# Altium schematic sheet Microcontroller.SchDoc: Microcontroller
size B; SheetNumber: 2; SheetTotal: 14
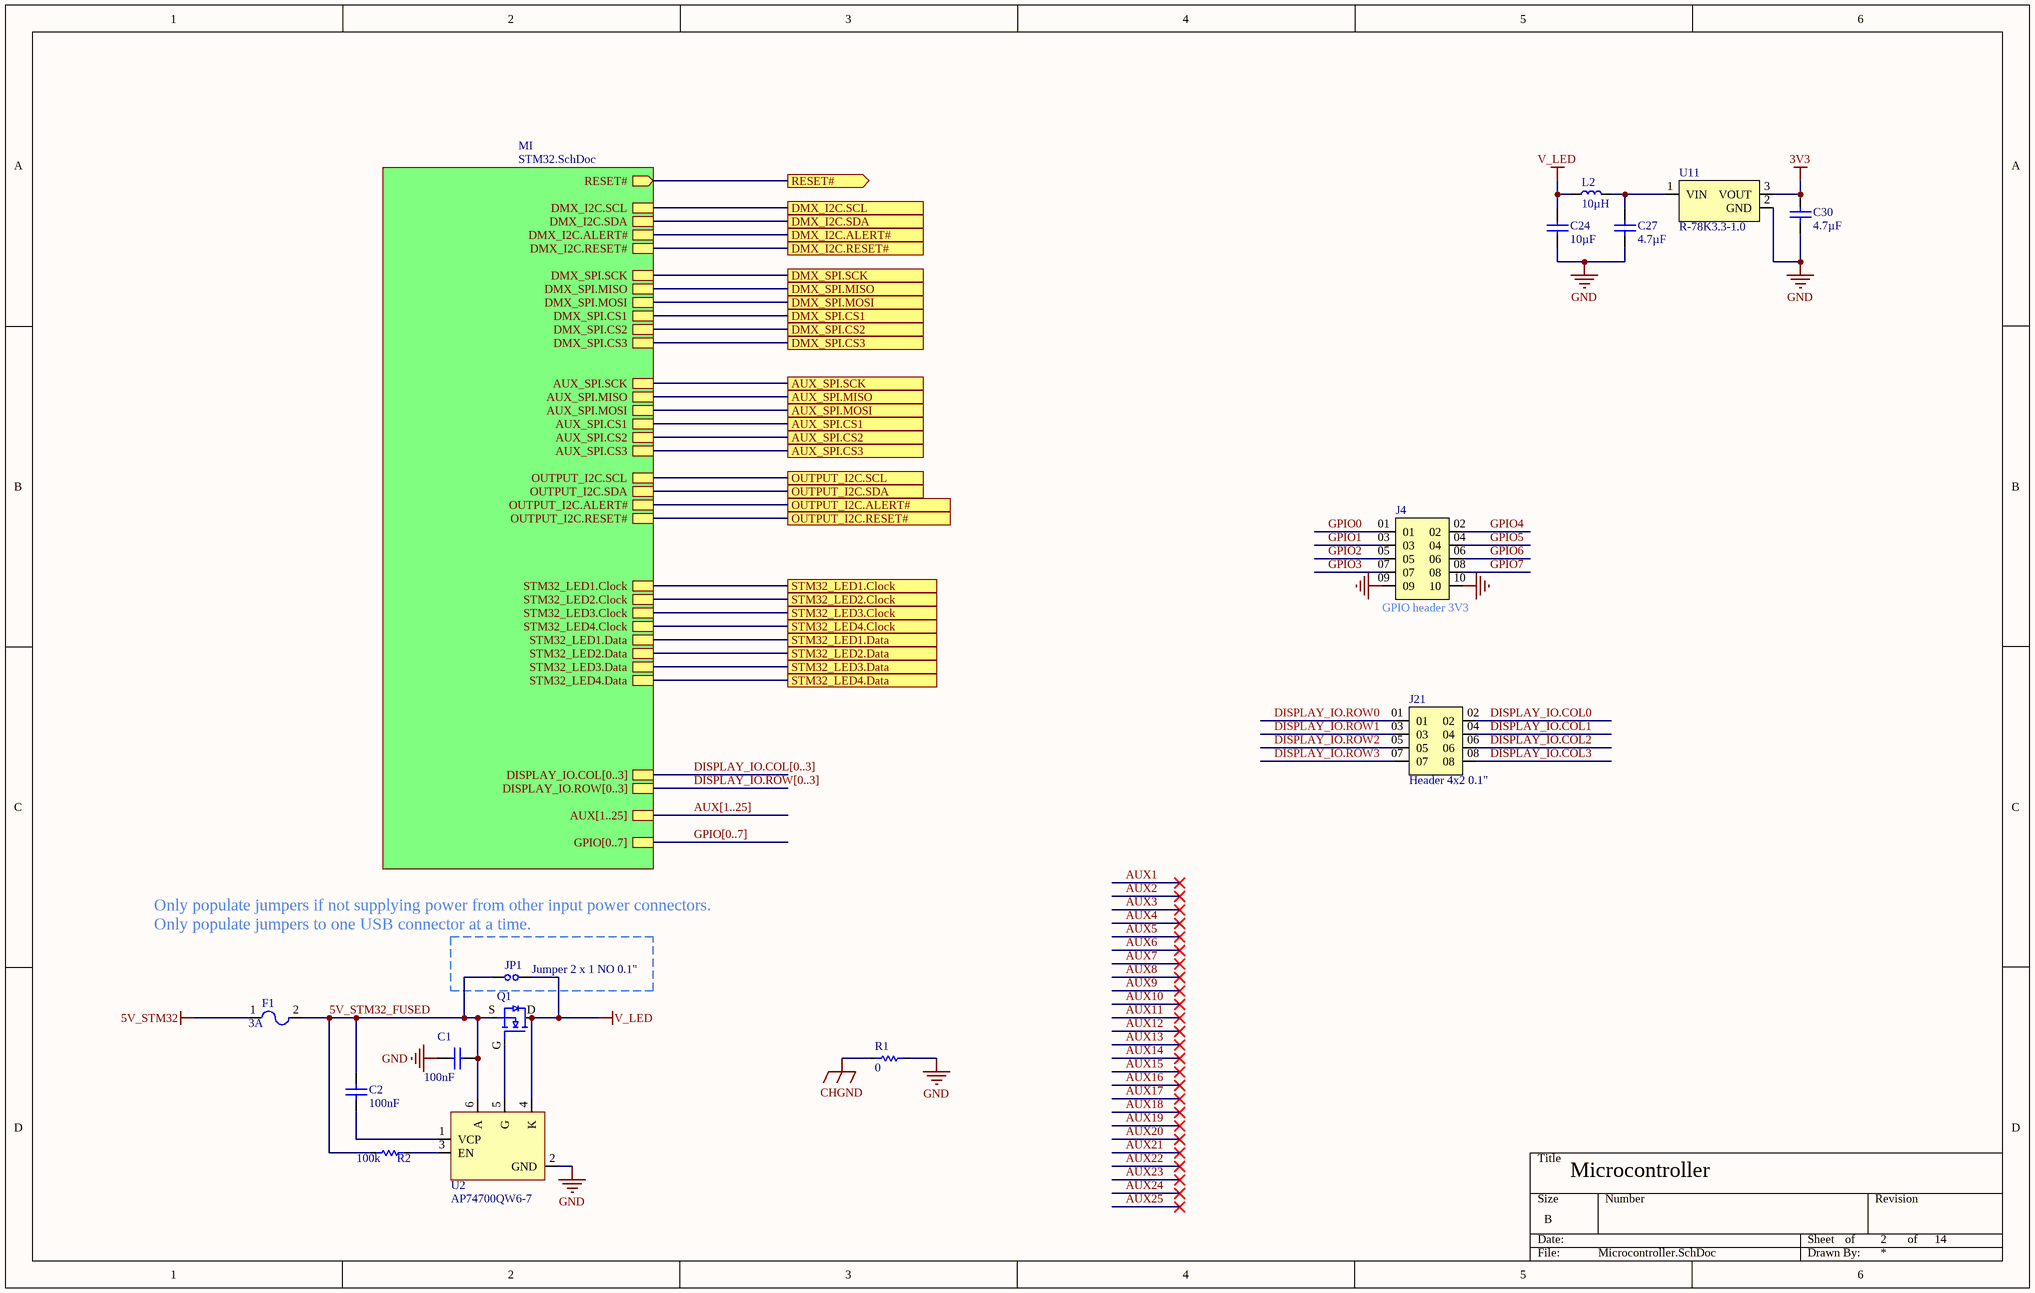
[diagram p0: Microcontroller.SchDoc]

## Parts
C1  value 100nF  [CAPC1608X10N_0603_MED]  (hidden comment: CC0603KRX7R0BB104)
C2  value 100nF  [CAPC1608X10N_0603_MED]  (hidden comment: CC0603KRX7R0BB104)
C24  value 10µF  [CAPC2012X14N_0805_MED]  (hidden comment: GRM21BR61H106KE43L)
C27  value 4.7µF  [CAPC2012X14N_0805_MED]  (hidden comment: GRM21BR61H475KE51L)
C30  value 4.7µF  [CAPC2012X14N_0805_MED]  (hidden comment: GRM21BR61H475KE51L)
F1  Current Rating: 3A  [FUSE4532X1.55N_1812MED]  (hidden comment: 0ZCG0300FF2B)
J4  Header 5x2 0.1"  [HEADER 5x2 0.1 Through hole]  (value not drawn)
J21  Header 4x2 0.1"  [Header 4x2 0.1"]
JP1  Jumper 2 x 1 NO 0.1"  [FP-M20-9990245-MFG]
L2  value 10µH  [FP-SRN5040-MFG]  (hidden comment: SRN5040-100M)
Q1  BUK9880-55A/CUX  [SOT230P700X180-4N]  (value not drawn)
R1  value 0  [RESC1608X06N_0603_MED]  (hidden comment: RC0603FR-070RL)
R2  value 100k  [RESC1608X06N_0603_MED]  (hidden comment: RC0603DR-07100KL)
U2  AP74700QW6-7  [SOT95P285X130-6N]
U11  R-78K3.3-1.0  [R-78K3.3-1.0-Footprint-1]

## Sub-sheets
MI = STM32.SchDoc: RESET# (out), AUX[1..25], GPIO[0..7], DISPLAY_IO.COL[0..3], DISPLAY_IO.ROW[0..3], DMX_I2C.SCL, DMX_I2C.SDA, DMX_I2C.ALERT#, DMX_I2C.RESET#, DMX_SPI.SCK, DMX_SPI.MISO, DMX_SPI.MOSI, DMX_SPI.CS1, DMX_SPI.CS2, DMX_SPI.CS3, AUX_SPI.SCK, AUX_SPI.MISO, AUX_SPI.MOSI, AUX_SPI.CS1, AUX_SPI.CS2, AUX_SPI.CS3, OUTPUT_I2C.SCL, OUTPUT_I2C.SDA, OUTPUT_I2C.ALERT#, OUTPUT_I2C.RESET#, STM32_LED1.Clock, STM32_LED2.Clock, STM32_LED3.Clock, STM32_LED4.Clock, STM32_LED1.Data, STM32_LED2.Data, STM32_LED3.Data, STM32_LED4.Data

## Ports
AUX_SPI.CS1, AUX_SPI.CS2, AUX_SPI.CS3, AUX_SPI.MISO, AUX_SPI.MOSI, AUX_SPI.SCK, DMX_I2C.ALERT#, DMX_I2C.RESET#, DMX_I2C.SCL, DMX_I2C.SDA, DMX_SPI.CS1, DMX_SPI.CS2, DMX_SPI.CS3, DMX_SPI.MISO, DMX_SPI.MOSI, DMX_SPI.SCK, OUTPUT_I2C.ALERT#, OUTPUT_I2C.RESET#, OUTPUT_I2C.SCL, OUTPUT_I2C.SDA, RESET# (out), STM32_LED1.Clock, STM32_LED1.Data, STM32_LED2.Clock, STM32_LED2.Data, STM32_LED3.Clock, STM32_LED3.Data, STM32_LED4.Clock, STM32_LED4.Data

## Nets
3V3: C30.2 U11.3(VOUT)
5V_STM32: F1.1
CHGND: R1.1
GND: C1.2 C24.1 C27.1 C30.1 J4.09 J4.10 R1.2 U2.2(GND) U11.2(GND)
V_LED: C24.2 JP1.2 L2.1 Q1.D U2.4(K)
5V_STM32_FUSED: C1.1 C2.2 F1.2 JP1.1 Q1.S R2.1 U2.6(A)
AUX_SPI.CS1: port AUX_SPI.CS1, sheet MI/AUX_SPI.CS1
AUX_SPI.CS2: port AUX_SPI.CS2, sheet MI/AUX_SPI.CS2
AUX_SPI.CS3: port AUX_SPI.CS3, sheet MI/AUX_SPI.CS3
AUX_SPI.MISO: port AUX_SPI.MISO, sheet MI/AUX_SPI.MISO
AUX_SPI.MOSI: port AUX_SPI.MOSI, sheet MI/AUX_SPI.MOSI
AUX_SPI.SCK: port AUX_SPI.SCK, sheet MI/AUX_SPI.SCK
DISPLAY_IO.COL0: J21.02
DISPLAY_IO.COL1: J21.04
DISPLAY_IO.COL2: J21.06
DISPLAY_IO.COL3: J21.08
DISPLAY_IO.ROW0: J21.01
DISPLAY_IO.ROW1: J21.03
DISPLAY_IO.ROW2: J21.05
DISPLAY_IO.ROW3: J21.07
DMX_I2C.ALERT#: port DMX_I2C.ALERT#, sheet MI/DMX_I2C.ALERT#
DMX_I2C.RESET#: port DMX_I2C.RESET#, sheet MI/DMX_I2C.RESET#
DMX_I2C.SCL: port DMX_I2C.SCL, sheet MI/DMX_I2C.SCL
DMX_I2C.SDA: port DMX_I2C.SDA, sheet MI/DMX_I2C.SDA
DMX_SPI.CS1: port DMX_SPI.CS1, sheet MI/DMX_SPI.CS1
DMX_SPI.CS2: port DMX_SPI.CS2, sheet MI/DMX_SPI.CS2
DMX_SPI.CS3: port DMX_SPI.CS3, sheet MI/DMX_SPI.CS3
DMX_SPI.MISO: port DMX_SPI.MISO, sheet MI/DMX_SPI.MISO
DMX_SPI.MOSI: port DMX_SPI.MOSI, sheet MI/DMX_SPI.MOSI
DMX_SPI.SCK: port DMX_SPI.SCK, sheet MI/DMX_SPI.SCK
GPIO0: J4.01
GPIO1: J4.03
GPIO2: J4.05
GPIO3: J4.07
GPIO4: J4.02
GPIO5: J4.04
GPIO6: J4.06
GPIO7: J4.08
OUTPUT_I2C.ALERT#: port OUTPUT_I2C.ALERT#, sheet MI/OUTPUT_I2C.ALERT#
OUTPUT_I2C.RESET#: port OUTPUT_I2C.RESET#, sheet MI/OUTPUT_I2C.RESET#
OUTPUT_I2C.SCL: port OUTPUT_I2C.SCL, sheet MI/OUTPUT_I2C.SCL
OUTPUT_I2C.SDA: port OUTPUT_I2C.SDA, sheet MI/OUTPUT_I2C.SDA
RESET#: port RESET#, sheet MI/RESET#
STM32_LED1.Clock: port STM32_LED1.Clock, sheet MI/STM32_LED1.Clock
STM32_LED1.Data: port STM32_LED1.Data, sheet MI/STM32_LED1.Data
STM32_LED2.Clock: port STM32_LED2.Clock, sheet MI/STM32_LED2.Clock
STM32_LED2.Data: port STM32_LED2.Data, sheet MI/STM32_LED2.Data
STM32_LED3.Clock: port STM32_LED3.Clock, sheet MI/STM32_LED3.Clock
STM32_LED3.Data: port STM32_LED3.Data, sheet MI/STM32_LED3.Data
STM32_LED4.Clock: port STM32_LED4.Clock, sheet MI/STM32_LED4.Clock
STM32_LED4.Data: port STM32_LED4.Data, sheet MI/STM32_LED4.Data
NetC2_1: C2.1 U2.1(VCP)
NetC27_2: C27.2 L2.2 U11.1(VIN)
NetQ1_G: Q1.G U2.5(G)
NetR2_2: R2.2 U2.3(EN)

## Buses and harness runs
bus AUX[1..25] = sheet MI/AUX[1..25]
bus DISPLAY_IO.COL[0..3] = sheet MI/DISPLAY_IO.COL[0..3]
bus DISPLAY_IO.ROW[0..3] = sheet MI/DISPLAY_IO.ROW[0..3]
bus GPIO[0..7] = sheet MI/GPIO[0..7]

## Notes on the sheet
- (near J4) GPIO header 3V3
- (near JP1) Only populate jumpers if not supplying power from other input power connectors.
  Only populate jumpers to one USB connector at a time.
- of

## Library data of the parts
C1 C2 = CMP-001-00102-4: Ceramic Capacitor, Multilayer, Ceramic, 100V, 10% +Tol, 10% -Tol, X7R, 15% TC, 0.1uF, Surface Mount, 0603; Max Operating Temperature: 125°C; RoHS Compliant: Yes; Case/Package: 0603; Mounting Technology: Surface Mount; Capacitor Type: Ceramic; Pins: 2; Voltage Rating: 100V; Min Operating Temperature: -55°C; JLCPN: C113803
C24 = CMP-001-00169-2: Ceramic Capacitor, Multilayer, Ceramic, 10uF, 50V, 10%, X6S, 0805; Mounting Technology: Surface Mount; Case/Package: 0805; Tolerance: 10%; RoHS Compliant: Yes; Capacitor Type: Ceramic; Max Operating Temperature: 85°C; Min Operating Temperature: -55°C; Pins: 2; Voltage Rating: 50V; JLCPN: C440198
C27 C30 = CMP-001-00165-2: Ceramic Capacitor, Multilayer, Ceramic, 50V, 10% +Tol, 10% -Tol, X5R, 15% TC, 4.7uF, Surface Mount, 0805; Min Operating Temperature: -55°C; Max Operating Temperature: 85°C; Voltage Rating: 50V; Mounting Technology: Surface Mount; Tolerance: 10%; Case/Package: 0805; RoHS Compliant: Yes; Capacitor Type: Ceramic; Pins: 2; JLCPN: C162420
F1 = CMP-005-00018-1: PTC Resettable Fuse, 6V, 3A Surface Mount; Max Operating Temperature: 85°C; Case/Package: 1812; Pins: 2; Mounting Technology: SMT; Min Operating Temperature: -40°C; RoHS Compliant: Yes
J4 = CMP-002-00228-3: Board Connector Tall, 10 Contact(s), 2 Row(s), Male, Straight, 0.1 inch Pitch; Max Current Rating: 3A; Mounting Technology: Board; RoHS Compliant: Yes; Gender: Male; Pins: 10; Connector Type: Header
J21 = CMP-002-00227-2: Board Connector, 8 Contact(s), 2 Row(s), Female, 0.1 inch Pitch; Gender: Male; Max Current Rating: 3A; Pins: 8; Max Operating Temperature: 105°C; Connector Type: BOARD CONNECTOR; RoHS Compliant: Yes; Min Operating Temperature: -40°C; Mounting Technology: Board
JP1 = CMP-002-00086-5: Connector Type: BOARD CONNECTOR; Pins: 2; Max Operating Temperature: 105°C; RoHS Compliant: Yes; Mounting Technology: Through Hole; Min Operating Temperature: -40°C
L2 = CMP-006-00030-2: General Purpose Inductor, 10uH, 20%, 1 Element, Ferrite-Core, SMD, 2020; Self Resonant Frequency: 17MHz; Max Current Rating: 2.1A; Min Operating Temperature: -40°C; Pins: 2; Mounting Technology: SMT; Max Operating Temperature: 125°C; Tolerance: 20%; RoHS Compliant: Yes; JLCPN: C1329529
Q1 = CMP-013-00051-4: BUK9880 Series 55 V 7A 73 mOhm N-Channel TrenchMOS Logic Level FET - SC-73; Vgs (Max): 15V; Pins: 4; Max Operating Temperature: 150°C; Case/Package: SOT; Vgs(th) (Max) @ Id: v; Min Operating Temperature: -55°C
R1 = CMP-009-00204-3: RC Series 0603 0.1 W 0 Ohm Jumper Surface Mount Thick Film Chip Resistor; Tolerance: 1%; Voltage Rating: 75V; Power: 100mW; Min Operating Temperature: -55°C; Pins: 2; Case/Package: 0603; Max Operating Temperature: 155°C; RoHS Compliant: Yes; Mounting Technology: Surface Mount; JLCPN: C100044
R2 = CMP-009-00328-2: Fixed Resistor, Metal Glaze/thick Film, 0.1W, 100000ohm, 75V, 0.5% +/-Tol, 100ppm/Cel, Surface Mount, 0603; Power: 100mW; Voltage Rating: 50V; RoHS Compliant: Yes; Max Operating Temperature: 155°C; JLCPN: C163504; Case/Package: 0603; Min Operating Temperature: -55°C; Pins: 2; Mounting Technology: Surface Mount; Tolerance: 0.5%
U2 = CMP-004-00052-1: ORController N-Channel Single Automotive AEC-Q100 6-Pin SOT-26 T/R; Min Operating Temperature: -40°C; Max Operating Temperature: 125°C
U11 = CMP-019-00075-1: R-78K-1.0 Series Single Output 3.3 V 1 A Non Isolated DC/DC Converter - SIP-3; Output Current: 1A; Min Supply Voltage: 4.75V; Output Voltage: 3.3V; Max Supply Voltage: 36V; Pins: 3